# EAGLE design z-two (EAGLE 7.2.0)
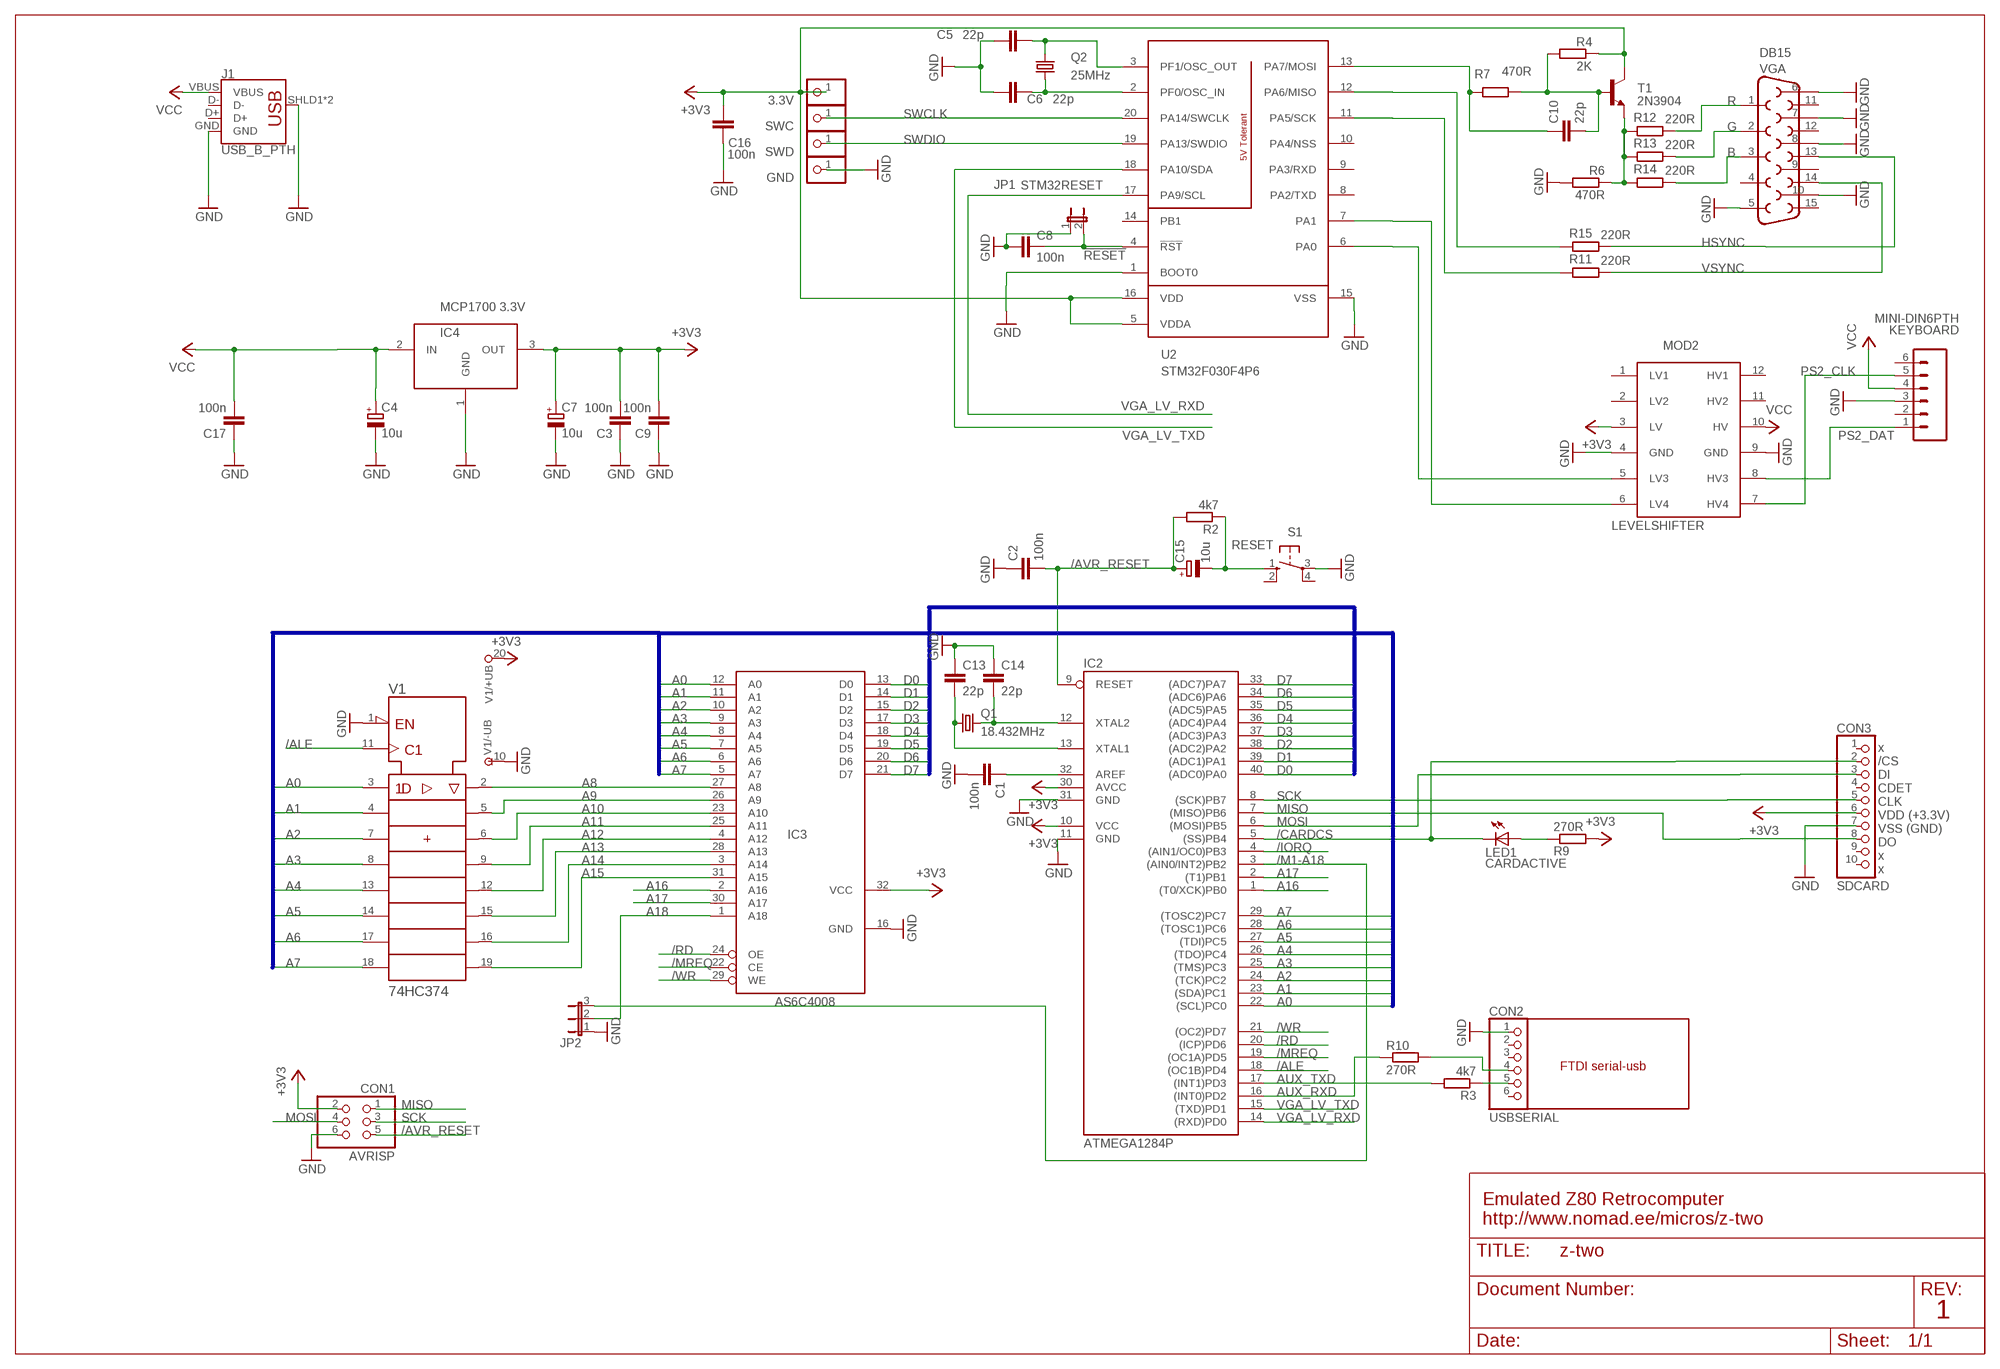
[diagram p0: schematic, sheet 1]

## Parts
3.3V  PINHD-1X1  [1X01]
C1  100n  C-EU025-025X050  [C025-025X050]
C2  100n  C-EU025-025X050  [C025-025X050]
C3  100n  C-EU025-025X050  [C025-025X050]
C4  10u  CPOL-EUE2.5-5  [E2,5-5]
C5  22p  C-EU025-025X050  [C025-025X050]
C6  22p  C-EU025-025X050  [C025-025X050]
C7  10u  CPOL-EUE2.5-5  [E2,5-5]
C8  100n  C-EU025-025X050  [C025-025X050]
C9  100n  C-EU025-025X050  [C025-025X050]
C10  22p  C-EU025-025X050  [C025-025X050]
C13  22p  C-EU025-025X050  [C025-025X050]
C14  22p  C-EU025-025X050  [C025-025X050]
C15  10u  CPOL-EUE2.5-5  [E2,5-5]
C16  100n  C-EU025-025X050  [C025-025X050]
C17  100n  C-EU025-025X050  [C025-025X050]
CON1  AVRISP  PINHD-2X3  [2X03]
CON2  USBSERIAL  PINHD-1X6  [1X06]
CON3  SDCARD  PINHD-1X10  [1X10]
GND  PINHD-1X1  [1X01]
IC2  ATMEGA1284P  MEGA32-P  [DIL40]
IC3  AS6C4008  AS6C4008DIP32  [DIP32]
IC4  MCP1700 3.3V  MCP1700TO92  [TO-92]
J1  USB_B_PTH  [USB-B-PTH]
JP1  STM32RESET  JUMPER-2PTH  [1X02]
JP2  JP2E  [JP2]
KEYBOARD  MINI-DIN6PTH  [MINI-DIN6]
LED1  CARDACTIVE  LED3MM  [LED3MM]
MOD2  LEVELSHIFTER  LEVELSHIFTERNARROW  [LAVELSHIFTER_N]
Q1  18.432MHz  CRYSTALHC49S  [HC49/S]
Q2  25MHz  CRYSTALHC49S  [HC49/S]
R2  4k7  R-EU_0204/7  [0204/7]
R3  4k7  R-EU_0204/7  [0204/7]
R4  2K  R-EU_0204/7  [0204/7]
R6  470R  R-EU_0204/7  [0204/7]
R7  470R  R-EU_0204/7  [0204/7]
R9  270R  R-EU_0204/7  [0204/7]
R10  270R  R-EU_0204/7  [0204/7]
R11  220R  R-EU_0204/7  [0204/7]
R12  220R  R-EU_0204/7  [0204/7]
R13  220R  R-EU_0204/7  [0204/7]
R14  220R  R-EU_0204/7  [0204/7]
R15  220R  R-EU_0204/7  [0204/7]
S1  RESET  10-XX  [B3F-10XX]
SWC  PINHD-1X1  [1X01]
SWD  PINHD-1X1  [1X01]
T1  2N3904  [TO92]
U2  STM32F030F4P6  MISC-PROCESSOR_STM32F030F4P6  [MISC-PROCESSOR_TSSOP20]
V1  74HC374  74374N  [DIL20]
VGA  DB15  [DB15]

## Nets
25MHZ: C5.2 Q2.2 U2.3(PF1/OSC_OUT)
!RESET: C8.1 JP1.2 U2.4(!RST)
+3V3: 3.3V.1 C3.2 C7.+ C9.2 C16.1 CON1.2 CON3.6 IC2.10(VCC) IC2.30(AVCC) IC3.32(VCC) IC4.3(OUT) MOD2.3(LV) R4.1 R9.2 T1.1(C) U2.5(VDDA) U2.16(VDD) V1.20(+UB)
/ALE: IC2.18((OC1B)PD4) V1.11(CLK)
/AVR_RESET: C2.2 C15.+ CON1.5 IC2.9(RESET) R2.2
/CARDCS: CON3.2 IC2.5((SS)PB4) LED1.K(C)
/IORQ: IC2.4((AIN1/OC0)PB3)
/M1-A18: IC2.3((AIN0/INT2)PB2) JP2.3
/MREQ: IC2.19((OC1A)PD5) IC3.22(CE)
/RD: IC2.20((ICP)PD6) IC3.24(OE)
/WR: IC2.21((OC2)PD7) IC3.29(WE)
A0: IC2.22((SCL)PC0) IC3.12(A0) V1.3(1D)
A1: IC2.23((SDA)PC1) IC3.11(A1) V1.4(2D)
A2: IC2.24((TCK)PC2) IC3.10(A2) V1.7(3D)
A3: IC2.25((TMS)PC3) IC3.9(A3) V1.8(4D)
A4: IC2.26((TDO)PC4) IC3.8(A4) V1.13(5D)
A5: IC2.27((TDI)PC5) IC3.7(A5) V1.14(6D)
A6: IC2.28((TOSC1)PC6) IC3.6(A6) V1.17(7D)
A7: IC2.29((TOSC2)PC7) IC3.5(A7) V1.18(8D)
A8: IC3.27(A8) V1.2(1Q)
A9: IC3.26(A9) V1.5(2Q)
A10: IC3.23(A10) V1.6(3Q)
A11: IC3.25(A11) V1.9(4Q)
A12: IC3.4(A12) V1.12(5Q)
A13: IC3.28(A13) V1.15(6Q)
A14: IC3.3(A14) V1.16(7Q)
A15: IC3.31(A15) V1.19(8Q)
A16: IC2.1((T0/XCK)PB0) IC3.2(A16)
A17: IC2.2((T1)PB1) IC3.30(A17)
A18: IC3.1(A18) JP2.2
AUX_RXD: IC2.16((INT0)PD2) R10.1
AUX_TXD: IC2.17((INT1)PD3) R3.2
B: R14.1 VGA.3
D0: IC2.40((ADC0)PA0) IC3.13(D0)
D1: IC2.39((ADC1)PA1) IC3.14(D1)
D2: IC2.38((ADC2)PA2) IC3.15(D2)
D3: IC2.37((ADC3)PA3) IC3.17(D3)
D4: IC2.36((ADC4)PA4) IC3.18(D4)
D5: IC2.35((ADC5)PA5) IC3.19(D5)
D6: IC2.34((ADC6)PA6) IC3.20(D6)
D7: IC2.33((ADC7)PA7) IC3.21(D7)
G: R13.1 VGA.2
GND: C1.2 C2.1 C3.1 C4.- C5.1 C6.1 C7.- C8.2 C9.1 C13.1 C14.1 C16.2 C17.1 CON1.6 CON2.1 CON3.7 GND.1 IC2.11(GND) IC2.31(GND) IC3.16(GND) IC4.1(GND) J1.GND J1.SHLD1(SHIELD) J1.SHLD2(SHIELD) JP1.1 JP2.1 KEYBOARD.3 MOD2.4(GND) MOD2.9(GND) R6.2 S1.3(P) U2.1(BOOT0) U2.15(VSS) V1.1(!OC) V1.10(-UB) VGA.5 VGA.6 VGA.7 VGA.8 VGA.10
HSYNC: R15.1 VGA.13
MISO: CON1.1 CON3.8 IC2.7((MISO)PB6)
MOSI: CON1.4 CON3.3 IC2.6((MOSI)PB5)
N$1: C6.2 Q2.1 U2.2(PF0/OSC_IN)
N$2: R15.2 U2.12(PA6/MISO)
N$4: R6.1 R12.2 R13.2 R14.2 T1.3(E)
N$5: C14.2 IC2.12(XTAL2) Q1.2
N$6: C1.1 IC2.32(AREF)
N$8: R11.2 U2.11(PA5/SCK)
N$9: MOD2.6(LV4) U2.7(PA1)
N$10: MOD2.5(LV3) U2.6(PA0)
N$11: C10.2 R4.2 R7.1 T1.2(B)
N$12: C10.1 R7.2 U2.13(PA7/MOSI)
N$15: CON2.5 R3.1
N$21: C13.2 IC2.13(XTAL1) Q1.1
N$104: CON2.4 R10.2
N$533: C15.- R2.1 S1.1(S)
N$693: LED1.A R9.1
PS2_CLK: KEYBOARD.5 MOD2.7(HV4)
PS2_DAT: KEYBOARD.1 MOD2.8(HV3)
R: R12.1 VGA.1
SCK: CON1.3 CON3.5 IC2.8((SCK)PB7)
SWCLK: SWC.1 U2.20(PA14/SWCLK)
SWDIO: SWD.1 U2.19(PA13/SWDIO)
VCC: C4.+ C17.2 IC4.2(IN) J1.VBUS KEYBOARD.4 MOD2.10(HV)
VGA_LV_RXD: IC2.14((RXD)PD0) U2.17(PA9/SCL)
VGA_LV_TXD: IC2.15((TXD)PD1) U2.18(PA10/SDA)
VSYNC: R11.1 VGA.14
Unconnected: CON2.2 CON2.3 CON2.6 CON3.1 CON3.4 CON3.9 CON3.10 J1.D+ J1.D- KEYBOARD.2 KEYBOARD.6 MOD2.1(LV1) MOD2.2(LV2) MOD2.11(HV2) MOD2.12(HV1) S1.2(S1) S1.4(P1) U2.8(PA2/TXD) U2.9(PA3/RXD) U2.10(PA4/NSS) U2.14(PB1) VGA.4 VGA.9 VGA.11 VGA.12 VGA.15

## Buses
A[0..15]
D[0..7]

## Notes on the sheet
- x
  /CS
  DI
  CDET
  CLK
  VDD (+3.3V)
  VSS (GND)
  DO
  x
  x
- FTDI serial-usb
- Emulated Z80 Retrocomputer
  http://www.nomad.ee/micros/z-two
- 1

## Library data of the parts
3.3V GND SWC SWD = pinhead:PINHD-1X1: PIN HEADER
C1-C3 C8 C9 C13 C14 C16 C17 = rcl:C-EU: CAPACITOR, European symbol; PARTNO: 0.1UF, 0603
C4 C7 C15 = rcl:CPOL-EU: POLARIZED CAPACITOR, European symbol
C5 C6 C10 = rcl:C-EU: CAPACITOR, European symbol; PARTNO: 22PF, 0603
CON1 = pinhead:PINHD-2X3: PIN HEADER
CON2 = pinhead:PINHD-1X6: PIN HEADER
CON3 = pinhead:PINHD-1X10: PIN HEADER
IC2 = atmel:MEGA32-P: MICROCONTROLLER 32 Kbytes FLASH 2 Kbytes SRAM 1 Kbytes EEPROM USART 8-channel 10 bit ADC Source: www.atmel.com .. doc2503.pdf; MPN: ATMEGA32-16PU; OC_FARNELL: 1661729; OC_NEWARK: 51P1794
IC3 = mast:AS6C4008
IC4 = mast:MCP1700
J1 = SparkFun-Connectors:USB_B: USB Type B Connector SparkFun Products: SparkFun Stepoko <https://www.sparkfun.com/products/13899> PTH; PROD_ID: CONN-08278; SF_ID: PRT-00139
JP1 = SparkFun-Retired:JUMPER-2: Jumper Basic 0.1" spaced jumper. Use with breakaway headers.
JP2 = jumper:JP2E: JUMPER
KEYBOARD = SparkFun-Retired:MINI-DIN6: Mini DIN 6 Connector SparkFun used to sell this connector and has used it on a couple designs, however the connector and the designs are now retired. Mini DIN 6 Connector [RETIRED] <https://www.sparkfun.com/products/retired/8509> SparkFun Key Counter - PS2 [RETIRED] <https://www.sparkfun.com/products/retired/8652> Commonly found on the back of a computer for PS2 keyboard and mice. Schematic and footprint are proven.
LED1 = led:LED: LED OSRAM: - CHIPLED LG R971, LG N971, LY N971, LG Q971, LY Q971, LO R971, LY R971 LH N974, LH R974 LS Q976, LO Q976, LY Q976 LO Q996 - Hyper CHIPLED LW Q18S LB Q993, LB Q99A, LB R99A - SideLED LS A670, LO A670, LY A670, LG A670, LP A670 LB A673, LV A673, LT A673, LW A673 LH A674 LY A675 LS A676, LA A676, LO A676, LY A676, LW A676 LS A679, LY A679, LG A679 - Hyper Micro SIDELED® LS Y876, LA Y876, LO Y876, LY Y876 LT Y87S - SmartLED LW L88C, LW L88S LB L89C, LB L89S, LG L890 LS L89K, LO L89K, LY L89K LS L896, LA L896, LO L896, LY L896 - TOPLED LS T670, LO T670, LY T670, LG T670, LP T670 LSG T670, LSP T670, LSY T670, LOP T670, LYG T670 LG T671, LOG T671, LSG T671 LB T673, LV T673, LT T673, LW T673 LH T674 LS T676, LA T676, LO T676, LY T676, LB T676, LH T676, LSB T676, LW T676 LB T67C, LV T67C, LT T67C, LS T67K, LO T67K, LY T67K, LW E67C LS E67B, LA E67B, LO E67B, LY E67B, LB E67C, LV E67C, LT E67C LW T67C LS T679, LY T679, LG T679 LS T770, LO T770, LY T770, LG T770, LP T770 LB T773, LV T773, LT T773, LW T773 LH T774 LS E675, LA E675, LY E675, LS T675 LS T776, LA T776, LO T776, LY T776, LB T776 LHGB T686 LT T68C, LB T68C - Hyper Mini TOPLED® LB M676 - Mini TOPLED Santana® LG M470 LS M47K, LO M47K, LY M47K Source: http://www.osram.convergy.de LUXEON: - LUMILED® LXK2-PW12-R00, LXK2-PW12-S00, LXK2-PW14-U00, LXK2-PW14-V00 LXK2-PM12-R00, LXK2-PM12-S00, LXK2-PM14-U00 LXK2-PE12-Q00, LXK2-PE12-R00, LXK2-PE12-S00, LXK2-PE14-T00, LXK2-PE14-U00 LXK2-PB12-K00, LXK2-PB12-L00, LXK2-PB12-M00, LXK2-PB14-N00, LXK2-PB14-P00, LXK2-PB14-Q00 LXK2-PR12-L00, LXK2-PR12-M00, LXK2-PR14-Q00, LXK2-PR14-R00 LXK2-PD12-Q00, LXK2-PD12-R00, LXK2-PD12-S00 LXK2-PH12-R00, LXK2-PH12-S00 LXK2-PL12-P00, LXK2-PL12-Q00, LXK2-PL12-R00 Source: www.luxeon.com KINGBRIGHT: KA-3528ASYC Source: www.kingbright.com
MOD2 = mast:LEVELSHIFTER
Q1 Q2 = crystal:CRYSTAL: CRYSTAL; OC_FARNELL: 1667008; OC_NEWARK: unknown
R2 R3 R10 = rcl:R-EU_: RESISTOR, European symbol
R4 = resistor:R-EU_: RESISTOR, European symbol; PARTNO: 2K, 0603
R6 R7 R9 = resistor:R-EU_: RESISTOR, European symbol; PARTNO: 475R, 0603
R11-R15 = resistor:R-EU_: RESISTOR, European symbol
S1 = switch-omron:10-XX: OMRON SWITCH; MPN: B3F-1000; OC_FARNELL: 176432; OC_NEWARK: 36M3542
T1 = transistor:2N3904: NPN TRANSISTOR
U2 = z80_tiny:MISC-PROCESSOR_STM32F030F4P6
V1 = 74ttl-din:74*374: Octal D type transparent LATCH, edge triggered
VGA = SparkFun-Retired:DB15: DB15 / VGA right angle through-hole female connector.

## Board
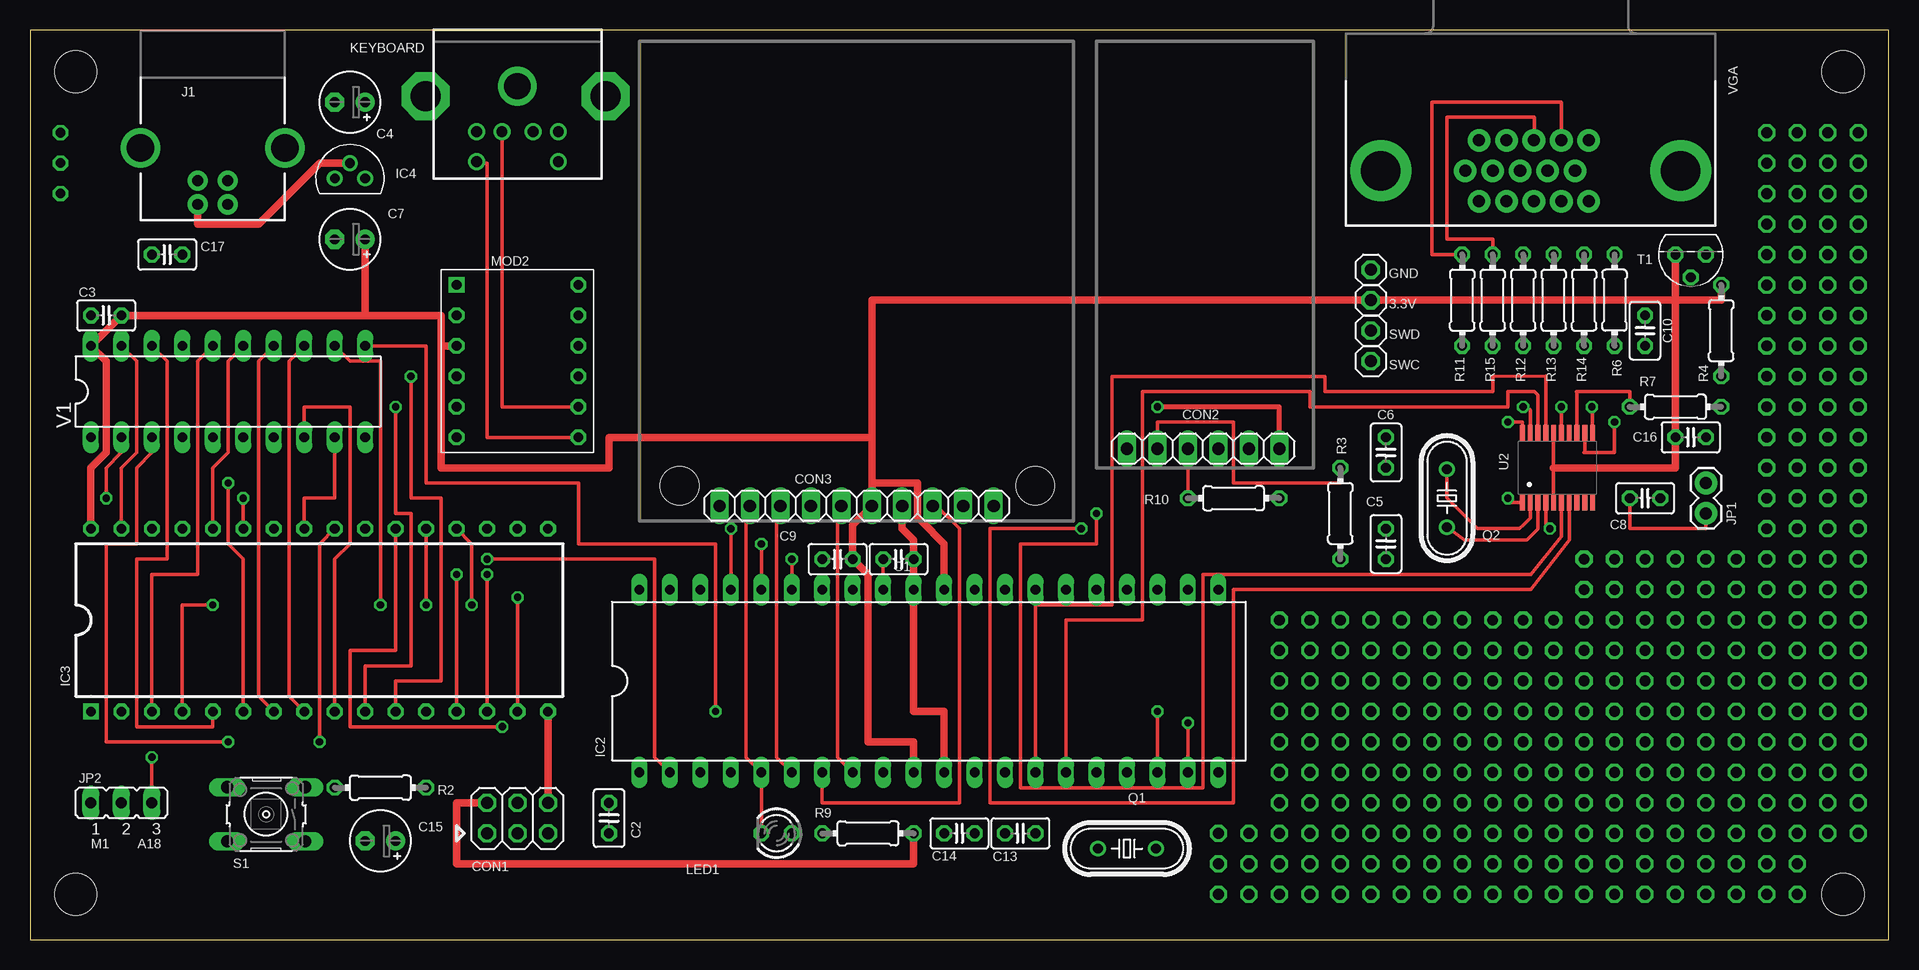
[diagram p1: board, top side]
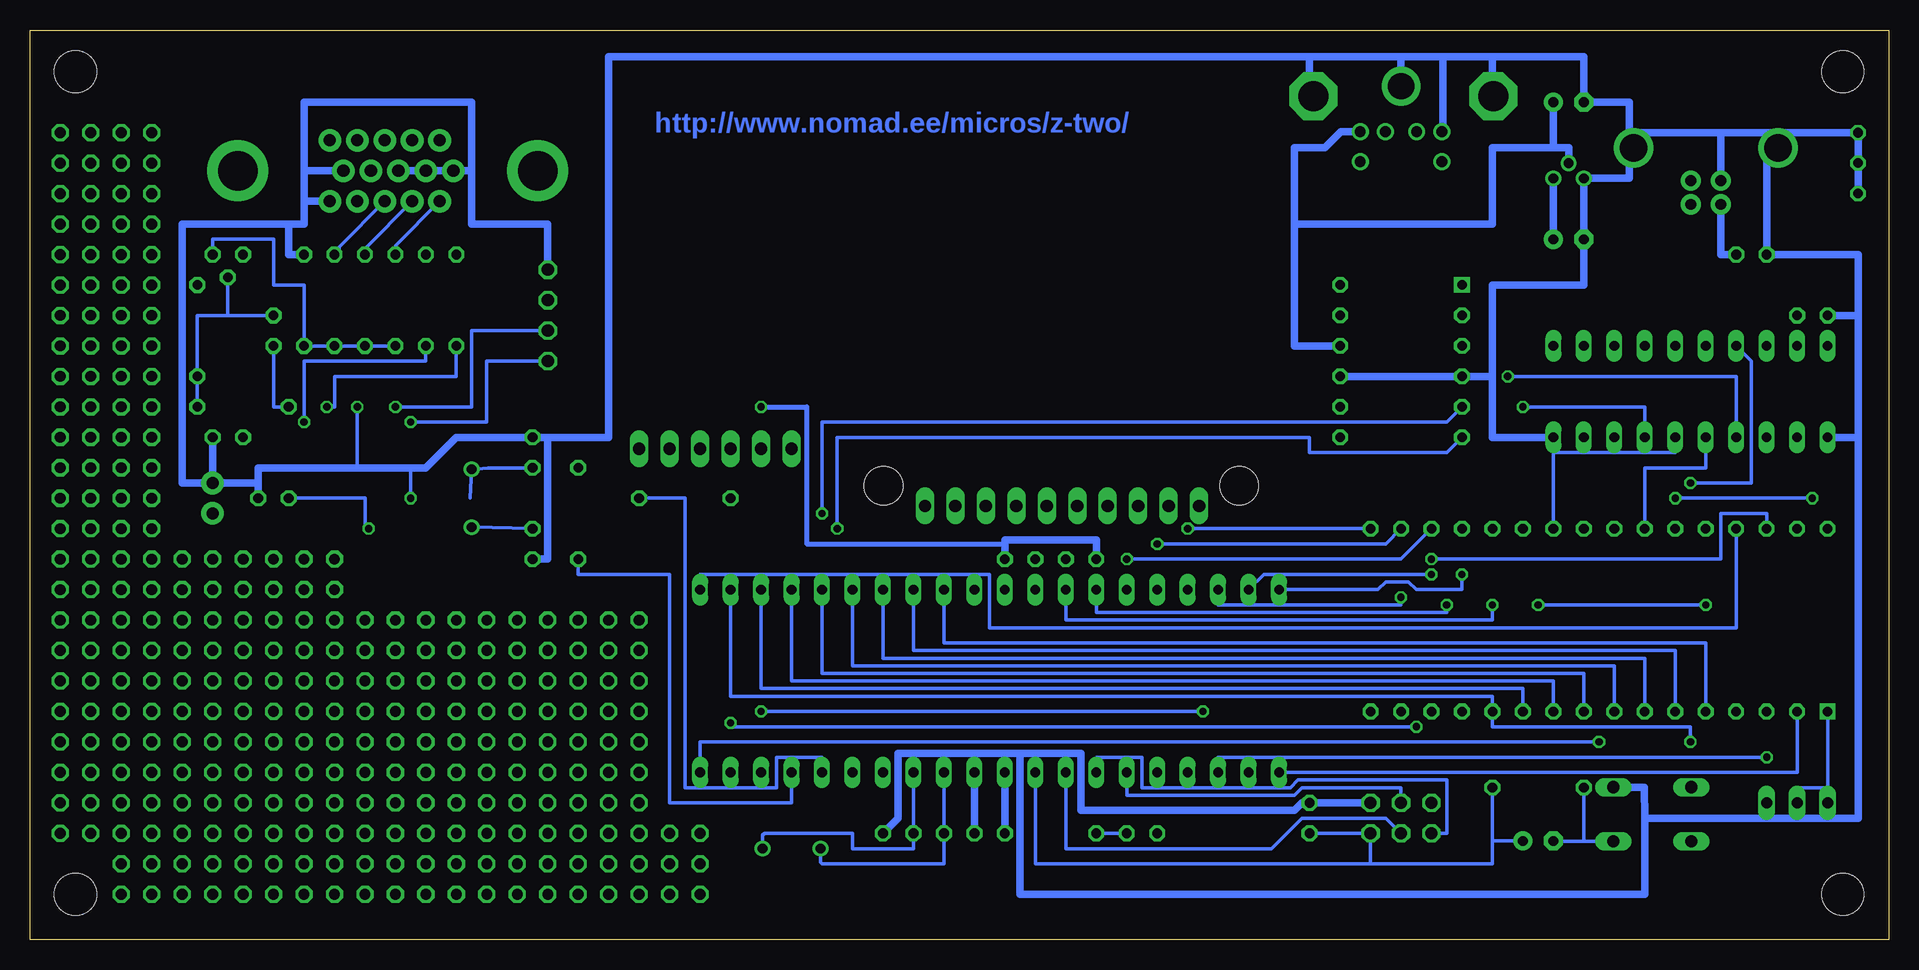
[diagram p2: board, bottom side, seen from below]

Size 154.92 x 75.87 mm. Coordinates in mm from the lower left corner, seen from the top.
Outline: 0,0 154.92,0 154.92,75.87 0,75.87 0,0
Copper layers (1*16): Top 0.035mm / dielectric 1.5mm / Bottom 0.035mm
Design rules "default *": minimum track width 10mil, minimum drill 0.3mm, track to track 10mil, track to pad 8mil, pad to pad 8mil, via to via 8mil, smd to smd 8mil, copper to edge 40mil, drill to drill 10mil, minimum pad ring 10mil, minimum via ring 8mil, stop-mask expansion 4mil, vias tented up to drill 0mil, thermal gap 10mil
Holes 3.5 mm at 3.81,72.39 3.81,3.81 151.13,3.81 151.13,72.39
Holes 3.2 mm at 83.78,37.87 54.14,37.87

### Footprints (pad centres in the part's own frame; a part is rotated, then mirrored left to right if it is on the bottom)
1X01 = drill 1.016 octagon: 1 0,0
C025-025X050 = drill 0.813 octagon: 1 -1.27,0; 2 1.27,0
E2,5-5 = drill 0.813 pad 1.6: + -1.27,0 | drill 0.813 pad 1.6 octagon: - 1.27,0
2X03 = drill 1.016 octagon: 1 -2.54,-1.27; 2 -2.54,1.27; 3 0,-1.27; 4 0,1.27; 5 2.54,-1.27; 6 2.54,1.27
1X06 = drill 1.016 long: 1 -6.35,0; 2 -3.81,0; 3 -1.27,0; 4 1.27,0; 5 3.81,0; 6 6.35,0
1X10 = drill 1.016 long: 1 -11.43,0; 2 -8.89,0; 3 -6.35,0; 4 -3.81,0; 5 -1.27,0; 6 1.27,0; 7 3.81,0; 8 6.35,0; 9 8.89,0; 10 11.43,0
DIL40 = drill 0.813 long: 1 -24.13,-7.62; 2 -21.59,-7.62; 3 -19.05,-7.62; 4 -16.51,-7.62; 5 -13.97,-7.62; 6 -11.43,-7.62; 7 -8.89,-7.62; 8 -6.35,-7.62; 9 -3.81,-7.62; 10 -1.27,-7.62; 11 1.27,-7.62; 12 3.81,-7.62; 13 6.35,-7.62; 14 8.89,-7.62; 15 11.43,-7.62; 16 13.97,-7.62; 17 16.51,-7.62; 18 19.05,-7.62; 19 21.59,-7.62; 20 24.13,-7.62; 21 24.13,7.62; 22 21.59,7.62; 23 19.05,7.62; 24 16.51,7.62; 25 13.97,7.62; 26 11.43,7.62; 27 8.89,7.62; 28 6.35,7.62; 29 3.81,7.62; 30 1.27,7.62; 31 -1.27,7.62; 32 -3.81,7.62; 33 -6.35,7.62; 34 -8.89,7.62; 35 -11.43,7.62; 36 -13.97,7.62; 37 -16.51,7.62; 38 -19.05,7.62; 39 -21.59,7.62; 40 -24.13,7.62
DIP32 = drill 0.8 square: 1 -7.62,19.05 | drill 0.8 octagon: 2 -7.62,16.51; 3 -7.62,13.97; 4 -7.62,11.43; 5 -7.62,8.89; 6 -7.62,6.35; 7 -7.62,3.81; 8 -7.62,1.27; 9 -7.62,-1.27; 10 -7.62,-3.81; 11 -7.62,-6.35; 12 -7.62,-8.89; 13 -7.62,-11.43; 14 -7.62,-13.97; 15 -7.62,-16.51; 16 -7.62,-19.05; 17 7.62,-19.05; 18 7.62,-16.51; 19 7.62,-13.97; 20 7.62,-11.43; 21 7.62,-8.89; 22 7.62,-6.35; 23 7.62,-3.81; 24 7.62,-1.27; 25 7.62,1.27; 26 7.62,3.81; 27 7.62,6.35; 28 7.62,8.89; 29 7.62,11.43; 30 7.62,13.97; 31 7.62,16.51; 32 7.62,19.05
TO-92 = drill 0.8: 1 0,1.27; 2 1.27,0; 3 0,-1.27
USB-B-PTH = drill 0.914 pad 1.676: D+ 4,1.25; D- 5.981,1.25; GND 4,-1.25; VBUS 5.981,-1.25 | drill 2.286: SHLD1 1.282,-6.02; SHLD2 1.282,6.02
1X02 = drill 1.016 pad 1.88: 1 0,0; 2 2.54,0
JP2 = drill 0.914 long: 1 -2.54,0; 2 0,0; 3 2.54,0
MINI-DIN6 = drill 0.9: 1 -1.3,-8.5; 2 1.3,-8.5; 3 -3.4,-8.5; 4 3.4,-8.5; 5 -3.4,-11; 6 3.4,-11 | drill 2.2: P$1 0,-4.7
LED3MM = drill 0.813 octagon: A -1.27,0; K 1.27,0
LAVELSHIFTER_N = drill 0.8 square: 1 -6.35,-5.08 | drill 0.8 octagon: 2 -3.81,-5.08; 3 -1.27,-5.08; 4 1.27,-5.08; 5 3.81,-5.08; 6 6.35,-5.08; 7 6.35,5.08; 8 3.81,5.08; 9 1.27,5.08; 10 -1.27,5.08; 11 -3.81,5.08; 12 -6.35,5.08
HC49/S = drill 0.813: 1 -2.413,0; 2 2.413,0
0204/7 = drill 0.813 octagon: 1 -3.81,0; 2 3.81,0
B3F-10XX = drill 1.016 long: 1 -3.251,2.261; 2 3.251,2.261; 3 -3.251,-2.261; 4 3.251,-2.261
TO92 = drill 0.813 octagon: 1 1.27,0; 2 0,1.905; 3 -1.27,0
MISC-PROCESSOR_TSSOP20 = smd 0.4 x 1.35: 1 -2.925,-2.875; 2 -2.275,-2.875; 3 -1.625,-2.875; 4 -0.975,-2.875; 5 -0.325,-2.875; 6 0.325,-2.875; 7 0.975,-2.875; 8 1.625,-2.875; 9 2.275,-2.875; 10 2.925,-2.875; 11 2.925,2.875; 12 2.275,2.875; 13 1.625,2.875; 14 0.975,2.875; 15 0.325,2.875; 16 -0.325,2.875; 17 -0.975,2.875; 18 -1.625,2.875; 19 -2.275,2.875; 20 -2.925,2.875
DIL20 = drill 0.813 long: 1 -11.43,-3.81; 2 -8.89,-3.81; 3 -6.35,-3.81; 4 -3.81,-3.81; 5 -1.27,-3.81; 6 1.27,-3.81; 7 3.81,-3.81; 8 6.35,-3.81; 9 8.89,-3.81; 10 11.43,-3.81; 11 11.43,3.81; 12 8.89,3.81; 13 6.35,3.81; 14 3.81,3.81; 15 1.27,3.81; 16 -1.27,3.81; 17 -3.81,3.81; 18 -6.35,3.81; 19 -8.89,3.81; 20 -11.43,3.81
DB15 = drill 1.016 pad 1.88: 1 -4.32,-7.62; 2 -2.03,-7.62; 3 0.26,-7.62; 4 2.55,-7.62; 5 4.84,-7.62; 6 -5.46,-5.08; 7 -3.17,-5.08; 8 -0.88,-5.08; 9 1.41,-5.08; 10 3.7,-5.08; 11 -4.32,-2.54; 12 -2.03,-2.54; 13 0.26,-2.54; 14 2.55,-2.54; 15 4.84,-2.54 | drill 3.302 pad 5.08: G1 -12.5,-5.08; G2 12.5,-5.08

### Placement (x,y rotation side)
3.3V  111.76,53.34 0 top
C1  72.39,31.75 0 top
C2  48.26,10.16 270 top
C3  6.35,52.07 0 top
C4  26.67,69.85 180 top
C5  113.03,33.02 90 top
C6  113.03,40.64 270 top
C7  26.67,58.42 180 top
C8  134.62,36.83 0 top
C9  67.31,31.75 0 top
C10  134.62,50.8 90 top
C13  82.55,8.89 180 top
C14  77.47,8.89 0 top
C15  29.21,8.25 180 top
C16  138.43,41.91 0 top
C17  11.43,57.15 0 top
CON1  40.64,10.16 0 top
CON2  97.79,40.96 180 top
CON3  68.9,36.2 0 top
GND  111.76,55.88 0 top
IC2  74.93,21.59 0 top
IC3  24.13,26.67 90 top
IC4  26.67,63.5 90 top
J1  15.24,67.31 270 top
JP1  139.7,38.1 270 top
JP2  7.62,11.43 0 top
KEYBOARD  40.64,75.88 0 top
LED1  62.23,8.89 180 top
MOD2  40.64,48.26 270 top
Q1  91.44,7.62 180 top
Q2  118.11,36.83 270 top
R2  29.21,12.7 0 top
R3  109.22,35.56 270 top
R4  140.97,50.8 270 top
R6  132.08,53.34 90 top
R7  137.16,44.45 180 top
R9  69.85,8.89 0 top
R10  100.33,36.83 180 top
R11  119.38,53.34 270 top
R12  124.46,53.34 270 top
R13  127,53.34 270 top
R14  129.54,53.34 270 top
R15  121.92,53.34 270 top
S1  19.68,10.48 180 top
SWC  111.76,48.26 0 top
SWD  111.76,50.8 0 top
T1  138.43,57.15 180 top
U2  127.32,39.37 0 top
V1  16.51,45.72 0 top
VGA  125.09,69.22 0 top

### Tracks (layer width: path | path; a pad name or v marks a point on that pad's centre or on a via)
25MHZ
  Top 0.305: U2.3 125.69,34.25 124.78,33.34 123.51,33.34 119.57,33.34 Q2.2
  Bottom 0.305: Q2.2 C5.2
!RESET  (via drill 0.6 pad 0.61)
  Top 0.305: 133.35,34.29 139.7,34.29 | 139.7,34.29 JP1.2 | 133.35,34.29 139.7,34.29 | 133.35,34.29 C8.1 | U2.4 126.34,34.63 v126.68,34.29
  Bottom 0.305: C8.1 127,36.83 127,34.29 v126.68,34.29
+3V3
  Top 0.305: 74.3,34.92 73.98,35.24 | 70.17,38.1 CON3.6 | U2.5 126.99,39.37 U2.16 | 137.16,49.53 137.16,53.34
  Top 0.61: IC3.32 5.08,39.37 6.35,40.64 6.35,48.26 V1.20 C3.2 27.94,52.07 | 27.94,52.07 C7.+ | IC2.10 73.66,16.51 71.12,16.51 69.85,16.51 69.85,27.94 69.85,30.48 C9.2 68.58,34.61 CON3.6 70.17,40.64 70.17,41.91 | IC2.30 76.2,33.02 74.3,34.92 | 73.98,35.24 73.98,38.1 70.17,38.1 | 27.94,52.07 34.29,52.07 34.29,49.53 | 34.29,49.53 34.29,39.37 48.26,39.37 48.26,41.91 70.17,41.91 | MOD2.3 34.29,49.53 | CON1.2 35.56,11.43 35.56,6.35 73.66,6.35 R9.2 | 137.16,53.34 3.3V.1 70.17,53.34 70.17,41.91 | 137.16,53.34 137.16,49.53 137.16,44.45 | 137.16,53.34 T1.1 | 137.16,44.45 C16.1 137.16,44.45 | 137.16,44.45 137.16,39.37 127,39.37 | 127,39.37 126.99,39.37 127,39.37 | R4.1 140.97,53.34 137.16,53.34
  Bottom 0.61: R9.2 IC2.10 | IC4.3 C7.+
/ALE  (via drill 0.6 pad 0.61)
  Top 0.305: V1.11 33.02,49.53 33.02,38.1 35.56,38.1 45.72,38.1 45.72,36.83 45.72,33.02 57.15,33.02 v57.15,19.05 | v93.98,19.05 IC2.18
  Bottom 0.305: v57.15,19.05 v93.98,19.05
/AVR_RESET
  Bottom 0.305: C15.+ 33.02,8.25 | 33.02,8.25 R2.2 | CON1.5 43.18,6.35 | 43.18,6.35 33.02,6.35 33.02,8.25 | CON1.5 43.18,6.35 | 43.18,6.35 71.12,6.35 IC2.9 | C2.2 CON1.5
/CARDCS
  Top 0.305: LED1.K IC2.5 59.69,15.24 59.69,35.88 CON3.2
/M1-A18  (via drill 0.6 pad 0.61)
  Top 0.305: JP2.3 v10.16,15.24
  Bottom 0.305: IC2.3 55.88,15.24 v10.16,15.24
/MREQ  (via drill 0.6 pad 0.41)
  Top 0.305: IC3.22 30.48,24.13 26.67,24.13 26.67,17.78 v39.37,17.78 | IC2.19 v96.52,18.1
  Bottom 0.305: v39.37,17.78 96.52,17.78 96.84,18.1 v96.52,18.1
/RD  (via drill 0.6 pad 0.41)
  Top 0.305: IC3.24 24.13,33.02 24.13,17.78 v24.13,16.51
  Bottom 0.305: v24.13,16.51 45.72,16.51 46.04,16.51 86.04,16.51 99.06,16.51 IC2.20
/WR
  Bottom 0.305: IC3.29 12.7,26.04 74.93,26.04 74.93,30.48 99.06,30.48 IC2.21
A0  (via drill 0.6 pad 0.41)
  Top 0.305: V1.3 10.16,40.64 8.89,39.37 8.89,33.02 7.62,33.02 6.35,33.02 6.35,16.51 v16.51,16.51
  Bottom 0.305: IC2.22 96.52,21.59 96.52,20.32 33.02,20.32 IC3.12 33.02,17.78 31.75,17.78 16.51,17.78 v16.51,16.51
A1  (via drill 0.6 pad 0.41)
  Top 0.305: v31.75,46.99 31.75,36.83 34.29,36.83 34.29,22.86 34.29,21.59 30.48,21.59 IC3.11
  Bottom 0.305: IC2.23 93.98,21.59 93.98,20.96 30.48,20.96 IC3.11 | V1.4 12.7,46.99 v31.75,46.99
A2  (via drill 0.6 pad 0.41)
  Top 0.305: v30.48,44.45 30.48,35.56 31.75,35.56 31.75,22.86 27.94,22.86 IC3.10
  Bottom 0.305: IC2.24 91.44,21.59 27.94,21.59 IC3.10 | V1.7 20.32,44.45 v30.48,44.45
A3
  Top 0.305: IC3.9 25.4,31.75 26.67,33.02 26.67,36.83 26.67,39.37 26.67,44.45 22.86,44.45 V1.8
  Bottom 0.305: IC2.25 88.9,22.54 88.9,22.22 75.88,22.22 58.42,22.22 25.4,22.22 IC3.9
A4
  Top 0.305: V1.13 21.59,48.26 21.59,20.32 IC3.8
  Bottom 0.305: IC2.26 86.36,22.86 76.2,22.86 58.42,22.86 22.86,22.86 IC3.8
A5
  Top 0.305: V1.14 19.05,48.26 19.05,21.59 19.05,20.32 IC3.7
  Bottom 0.305: IC2.27 83.82,23.5 76.2,23.5 58.42,23.5 20.32,23.5 IC3.7
A6  (via drill 0.6 pad 0.41)
  Top 0.305: IC3.6 17.78,31.75 16.51,33.02 v16.51,38.1
  Bottom 0.305: IC2.28 81.28,24.13 76.2,24.13 58.42,24.13 17.78,24.13 IC3.6 | v16.51,38.1 11.43,38.1 11.43,48.26 V1.17
A7
  Top 0.305: IC3.5 15.24,17.78 8.89,17.78 8.89,31.75 11.43,31.75 11.43,48.26 V1.18
  Bottom 0.305: IC2.29 78.74,24.77 76.2,24.77 58.42,24.77 15.24,24.77 IC3.5
A8  (via drill 0.6 pad 0.41)
  Top 0.305: V1.2 7.62,40.64 6.35,39.37 v6.35,36.83 | v17.78,36.83 IC3.27
  Bottom 0.305: v6.35,36.83 v17.78,36.83
A9
  Bottom 0.305: IC3.26 20.32,39.37 15.24,39.37 V1.5
A10
  Bottom 0.305: IC3.23 27.94,40.64 17.78,40.64 V1.6
A11
  Top 0.305: IC3.25 22.86,36.83 25.4,36.83 V1.9
A12  (via drill 0.6 pad 0.41)
  Top 0.305: V1.12 26.67,48.26 29.21,48.26 v29.21,27.94 | v15.24,27.94 12.7,27.94 IC3.4
  Bottom 0.305: v29.21,27.94 v15.24,27.94
A13
  Top 0.305: IC3.28 15.24,39.37 16.51,40.64 16.51,48.26 V1.15
A14
  Top 0.305: IC3.3 10.16,30.48 13.97,30.48 13.97,48.26 V1.16
A15
  Top 0.305: V1.19 8.89,48.26 8.89,40.64 7.62,39.37 IC3.31
A16
  Bottom 0.305: IC3.2 7.62,15.24 7.62,13.97 16.51,13.97 17.78,13.97 41.91,13.97 IC2.1
A17  (via drill 0.6 pad 0.41)
  Top 0.305: IC2.2 52.07,15.24 52.07,31.75 45.72,31.75 39.37,31.75 v38.1,31.75
  Bottom 0.305: v38.1,31.75 13.97,31.75 13.97,35.56 10.16,35.56 IC3.30
A18
  Bottom 0.305: JP2.2 7.62,12.7 5.08,12.7 IC3.1
AUX_RXD
  Bottom 0.305: R10.1 100.33,36.83 100.33,12.7 92.71,12.7 92.71,15.24 88.9,15.24 IC2.16
AUX_TXD
  Bottom 0.305: R3.2 109.22,30.48 101.6,30.48 101.6,22.86 101.6,11.43 91.44,11.43 IC2.17
B
  Bottom 0.305: R14.1 129.16,57.53 129.16,57.79 VGA.3
D0  (via drill 0.6 pad 0.41)
  Top 0.305: IC3.13 v35.56,30.48
  Bottom 0.305: v35.56,30.48 35.56,29.21 39.37,29.21 40.01,29.85 41.91,29.85 42.55,29.21 IC2.40
D1  (via drill 0.6 pad 0.41)
  Top 0.305: IC3.14 v38.1,30.48
  Bottom 0.305: v38.1,30.48 52.07,30.48 IC2.39
D2  (via drill 0.6 pad 0.41)
  Top 0.305: IC3.15 v40.64,28.57
  Bottom 0.305: v40.64,28.57 40.64,27.94 55.88,27.94 IC2.38
D3  (via drill 0.6 pad 0.41)
  Top 0.305: IC2.37 v58.42,34.29
  Bottom 0.305: v58.42,34.29 IC3.17
D4  (via drill 0.6 pad 0.41)
  Top 0.305: IC2.36 v60.96,33.02
  Bottom 0.305: v60.96,33.02 41.91,33.02 IC3.18
D5  (via drill 0.6 pad 0.41)
  Top 0.305: IC2.35 v63.5,31.75
  Bottom 0.305: v63.5,31.75 40.64,31.75 IC3.19
D6  (via drill 0.6 pad 0.41)
  Top 0.305: v36.83,27.94 36.83,33.02 IC3.20
  Bottom 0.305: IC2.34 66.04,27.94 66.04,27.31 36.83,27.31 v36.83,27.94
D7  (via drill 0.6 pad 0.41)
  Top 0.305: v33.02,27.94 IC3.21
  Bottom 0.305: IC2.33 68.58,27.94 68.58,26.67 33.02,26.67 v33.02,27.94
G
  Bottom 0.305: R13.1 127,57.66 VGA.2
GND  (via drill 0.6 pad 0.61, 0.8 pad 1.27)
  Top 0.305: U2.15 v127.64,44.44 v127.64,44.45 | U2.1 123.53,36.5 v123.19,36.83
  Top 0.406: CON2.1 104.14,44.45 v93.98,44.45
  Top 0.61: IC2.11 76.2,19.05 73.66,19.05 IC2.31 C1.2 73.66,33.34 72.71,34.29 CON3.7 | IC3.16 CON1.6
  Bottom 0.305: VGA.10 132.08,64.14 | 124.46,39.37 127.64,39.37 | 127.64,39.37 129.54,39.37 135.89,39.37 | 76.2,15.56 76.2,15.24 IC2.11 | 2.54,41.91 V1.1 | 2.54,52.07 C3.1 | 33.02,46.99 MOD2.4 | v127.64,44.45 127.64,39.37 | v123.19,36.83 123.19,39.37
  Bottom 0.406: v93.98,44.45 90.17,44.45 90.17,33.02 73.66,33.02
  Bottom 0.61: 13.99,67.29 J1.GND 13.99,67.29 | 13.99,67.29 13.97,67.31 | 13.97,67.31 8.89,67.31 | 8.89,67.31 8.89,66.36 J1.SHLD1 10.16,65.09 10.16,64.77 C17.1 2.54,57.15 2.54,52.07 | 13.99,67.29 13.97,67.31 | 13.97,67.31 21.59,67.31 | 21.59,67.31 21.59,66.36 J1.SHLD2 21.59,65.7 21.59,63.5 IC4.1 C7.- 25.4,54.61 33.02,54.61 33.02,49.53 33.02,48.26 33.02,46.99 | 21.59,67.31 21.59,69.85 C4.- 25.4,73.66 33.02,73.66 | 36.83,73.66 37.15,73.66 37.15,67.48 KEYBOARD.3 | 36.83,73.66 33.02,73.66 | R6.2 133.35,57.15 133.35,59.69 | 135.89,38.1 135.89,39.37 129.54,39.37 127.64,39.37 124.46,39.37 123.19,39.37 121.92,39.37 119.38,41.91 115.57,41.91 106.68,41.91 | 135.89,38.1 JP1.1 | VGA.8 VGA.7 VGA.6 118.11,64.14 | GND.1 111.76,59.69 113.03,59.69 118.11,59.69 118.11,62.23 118.11,64.14 | JP1.1 142.24,38.1 142.24,59.69 133.35,59.69 | 132.08,64.14 132.08,63.11 132.08,61.59 | C8.2 135.89,38.1 | 135.89,38.1 JP1.1 | VGA.10 132.08,64.14 | 132.08,64.14 132.08,69.85 118.11,69.85 118.11,64.14 | 33.02,73.66 33.02,72.39 | 36.83,73.66 40.64,73.66 | 40.64,73.66 40.64,72.39 | 40.64,73.66 48.26,73.66 | 48.26,73.66 48.26,71.76 | C5.1 111.76,31.75 111.76,41.91 C6.1 106.68,41.91 | C16.2 JP1.1 | 8.89,67.31 v2.54,67.31 v2.54,64.77 v2.54,62.23 | 2.54,52.07 C3.1 | C14.1 IC2.11 76.2,15.24 76.2,15.56 | C13.1 82.55,10.16 82.55,15.56 76.2,15.56 | 2.54,41.91 2.54,19.05 2.54,10.16 5.08,10.16 | V1.1 2.54,41.91 | 2.54,41.91 2.54,52.07 | CON1.6 C2.1 48.9,11.43 49.53,10.79 67.31,10.79 67.31,11.43 67.31,15.56 | 76.2,15.56 67.31,15.56 | 67.31,15.56 72.39,15.56 72.39,3.81 30.48,3.81 20.4,3.81 20.32,3.81 | V1.10 30.48,41.91 33.02,41.91 33.02,46.99 | MOD2.9 MOD2.4 33.02,46.99
  Bottom 0.61: 106.68,41.91 106.68,73.66 48.26,73.66 | 73.66,33.34 72.71,33.34 | 72.71,33.34 66.04,33.34 66.04,33.02 C9.1 | 72.71,33.34 73.34,33.34 73.66,33.34 | 73.66,33.34 73.66,33.02 C1.2 | 20.32,3.81 20.32,10.16 | 20.32,10.16 5.08,10.16 | S1.3 20.36,12.74 20.32,10.16 | 20.32,10.16 20.32,3.81 | JP2.1 5.08,10.16 | 132.08,61.59 VGA.5 | 133.35,59.69 132.08,59.69 132.08,61.59
HSYNC
  Top 0.305: R15.1 121.92,58.42 118.11,58.42 118.11,68.58 125.41,68.58 125.41,67.69 VGA.13
MISO
  Top 0.305: CON3.8 75.56,36.2 77.47,34.29 77.47,11.43 66.04,11.43 IC2.7
  Bottom 0.305: IC2.7 66.04,15.24 62.23,15.24 62.23,12.7 49.85,12.7 49.21,13.34 36.83,13.34 36.83,8.89 CON1.1
MOSI
  Top 0.305: IC2.6 62.23,15.24 62.23,35.88 CON3.3
  Bottom 0.305: CON1.4 40.64,12.7 46.99,12.7 48.26,12.7 48.9,12.7 49.53,12.07 63.5,12.07 63.5,12.38 IC2.6
N$1
  Top 0.305: U2.2 125.04,35.19 124.46,34.61 124.14,34.29 121.92,34.29 120.65,34.29 118.11,36.83 Q2.1
  Bottom 0.305: C6.2 116.71,39.37 Q2.1 118.24,36.83
N$2  (via drill 0.6 pad 0.61)
  Top 0.305: U2.12 129.59,40.69 129.54,40.64 132.08,40.64 v132.08,43.18
  Bottom 0.305: 132.08,44.45 v132.08,43.18 132.08,44.45 | 132.08,44.45 132.08,48.26 121.92,48.26 R15.2
N$4
  Bottom 0.305: R12.2 R13.2 R14.2 R6.1 132.08,50.8 132.08,54.61 134.62,54.61 134.62,58.42 139.7,58.42 T1.3
N$5
  Bottom 0.305: Q1.2 89.03,6.48 88.9,6.35 78.74,6.35 C14.2 IC2.12
N$6
  Top 0.305: C1.1 IC2.32
N$7  (via drill 0.9 pad 1.42)
  other vias: 106.68,24.13
N$8  (via drill 0.6 pad 0.61)
  Top 0.305: U2.11 130.24,44.38 v130.18,44.45
  Bottom 0.305: 129.54,44.45 v130.18,44.45 129.54,44.45 | 129.54,44.45 129.54,46.99 119.38,46.99 R11.2
N$9  (via drill 0.6 pad 0.41)
  Top 0.305: v87.63,34.29 80.01,34.29 80.01,27.94 80.01,11.43 100.33,11.43 100.33,26.67 100.33,29.21 111.12,29.21 125.09,29.21 128.29,33.36 U2.7
  Bottom 0.305: MOD2.6 36.83,40.64 48.26,40.64 48.26,41.91 87.63,41.91 v87.63,34.29
N$10  (via drill 0.6 pad 0.41)
  Top 0.305: U2.6 127.64,33.65 125.1,30.49 111.12,30.48 97.79,30.48 97.79,27.94 97.79,12.7 82.55,12.7 82.55,26.67 82.55,33.02 88.9,33.02 v88.9,35.56
  Bottom 0.305: MOD2.5 36.83,43.18 86.36,43.18 87.63,43.18 88.9,43.18 v88.9,35.56
N$11
  Bottom 0.305: R7.1 R4.2 140.97,52.07 138.43,52.07 | 138.43,52.07 T1.2 138.43,52.07 | 138.43,52.07 C10.2
N$12
  Top 0.305: R7.2 133.35,45.72 128.91,45.72 128.94,45.68 U2.13
  Bottom 0.305: C10.1 134.62,44.45 R7.2
N$13  (via drill 0.9 pad 1.42)
  other vias: 109.22,24.13
N$14  (via drill 0.9 pad 1.42)
  other vias: 104.14,24.13
N$15
  Top 0.305: R3.1 109.22,38.1 100.33,38.1 100.33,43.18 93.98,43.18 CON2.5
N$16  (via drill 0.9 pad 1.42)
  other vias: 111.76,24.13
N$17  (via drill 0.9 pad 1.42)
  other vias: 114.3,24.13
N$18  (via drill 0.9 pad 1.42)
  other vias: 116.84,24.13
N$19  (via drill 0.9 pad 1.42)
  other vias: 119.38,24.13
N$20  (via drill 0.9 pad 1.42)
  other vias: 121.92,24.13
N$21
  Bottom 0.305: Q1.1 93.85,8.76 93.66,8.89 91.44,8.89 86.36,8.89 86.36,7.62 81.28,7.62 81.28,10.16 | 81.28,10.16 C13.2 | IC2.13 81.28,10.16
N$22  (via drill 0.9 pad 1.42)
  other vias: 106.68,26.67
N$23  (via drill 0.9 pad 1.42)
  other vias: 124.46,24.13
N$24  (via drill 0.9 pad 1.42)
  other vias: 127,24.13
N$25  (via drill 0.9 pad 1.42)
  other vias: 129.54,24.13
N$26  (via drill 0.9 pad 1.42)
  other vias: 132.08,24.13
N$27  (via drill 0.9 pad 1.42)
  other vias: 134.62,24.13
N$28  (via drill 0.9 pad 1.42)
  other vias: 137.16,24.13
N$29  (via drill 0.9 pad 1.42)
  other vias: 139.7,24.13
N$30  (via drill 0.9 pad 1.42)
  other vias: 142.24,24.13
N$31  (via drill 0.9 pad 1.42)
  other vias: 144.78,24.13
N$32  (via drill 0.9 pad 1.42)
  other vias: 147.32,24.13
N$33  (via drill 0.9 pad 1.42)
  other vias: 149.86,24.13
N$34  (via drill 0.9 pad 1.42)
  other vias: 104.14,21.59
N$35  (via drill 0.9 pad 1.42)
  other vias: 106.68,21.59
N$36  (via drill 0.9 pad 1.42)
  other vias: 109.22,21.59
N$37  (via drill 0.9 pad 1.42)
  other vias: 111.76,21.59
N$38  (via drill 0.9 pad 1.42)
  other vias: 114.3,21.59
N$39  (via drill 0.9 pad 1.42)
  other vias: 116.84,21.59
N$40  (via drill 0.9 pad 1.42)
  other vias: 119.38,21.59
N$41  (via drill 0.9 pad 1.42)
  other vias: 121.92,21.59
N$42  (via drill 0.9 pad 1.42)
  other vias: 124.46,21.59
N$43  (via drill 0.9 pad 1.42)
  other vias: 127,21.59
N$44  (via drill 0.9 pad 1.42)
  other vias: 129.54,21.59
N$45  (via drill 0.9 pad 1.42)
  other vias: 132.08,21.59
N$46  (via drill 0.9 pad 1.42)
  other vias: 134.62,21.59
N$47  (via drill 0.9 pad 1.42)
  other vias: 137.16,21.59
N$48  (via drill 0.9 pad 1.42)
  other vias: 139.7,21.59
N$49  (via drill 0.9 pad 1.42)
  other vias: 142.24,21.59
N$50  (via drill 0.9 pad 1.42)
  other vias: 144.78,21.59
N$51  (via drill 0.9 pad 1.42)
  other vias: 147.32,21.59
N$52  (via drill 0.9 pad 1.42)
  other vias: 149.86,21.59
N$53  (via drill 0.9 pad 1.42)
  other vias: 104.14,19.05
N$54  (via drill 0.9 pad 1.42)
  other vias: 106.68,19.05
N$55  (via drill 0.9 pad 1.42)
  other vias: 147.32,26.67
N$56  (via drill 0.9 pad 1.42)
  other vias: 149.86,26.67
N$57  (via drill 0.9 pad 1.42)
  other vias: 147.32,29.21
N$58  (via drill 0.9 pad 1.42)
  other vias: 149.86,29.21
N$59  (via drill 0.9 pad 1.42)
  other vias: 147.32,31.75
N$60  (via drill 0.9 pad 1.42)
  other vias: 149.86,31.75
N$62  (via drill 0.9 pad 1.42)
  other vias: 149.86,34.29
N$64  (via drill 0.9 pad 1.42)
  other vias: 149.86,36.83
N$65  (via drill 0.9 pad 1.42)
  other vias: 147.32,39.37
N$66  (via drill 0.9 pad 1.42)
  other vias: 149.86,39.37
N$67  (via drill 0.9 pad 1.42)
  other vias: 147.32,41.91
N$68  (via drill 0.9 pad 1.42)
  other vias: 149.86,41.91
N$69  (via drill 0.9 pad 1.42)
  other vias: 147.32,44.45
N$70  (via drill 0.9 pad 1.42)
  other vias: 149.86,44.45
N$71  (via drill 0.9 pad 1.42)
  other vias: 147.32,46.99
N$72  (via drill 0.9 pad 1.42)
  other vias: 149.86,46.99
N$73  (via drill 0.9 pad 1.42)
  other vias: 147.32,49.53
N$74  (via drill 0.9 pad 1.42)
  other vias: 149.86,49.53
N$75  (via drill 0.9 pad 1.42)
  other vias: 147.32,52.07
N$76  (via drill 0.9 pad 1.42)
  other vias: 149.86,52.07
N$77  (via drill 0.9 pad 1.42)
  other vias: 147.32,54.61
N$78  (via drill 0.9 pad 1.42)
  other vias: 149.86,54.61
N$79  (via drill 0.9 pad 1.42)
  other vias: 147.32,57.15
N$80  (via drill 0.9 pad 1.42)
  other vias: 149.86,57.15
N$81  (via drill 0.9 pad 1.42)
  other vias: 147.32,59.69
N$82  (via drill 0.9 pad 1.42)
  other vias: 149.86,59.69
N$83  (via drill 0.9 pad 1.42)
  other vias: 147.32,62.23
N$84  (via drill 0.9 pad 1.42)
  other vias: 149.86,62.23
N$85  (via drill 0.9 pad 1.42)
  other vias: 147.32,64.77
N$86  (via drill 0.9 pad 1.42)
  other vias: 149.86,64.77
N$87  (via drill 0.9 pad 1.42)
  other vias: 147.32,67.31
N$88  (via drill 0.9 pad 1.42)
  other vias: 149.86,67.31
N$89  (via drill 0.9 pad 1.42)
  other vias: 104.14,16.51
N$90  (via drill 0.9 pad 1.42)
  other vias: 104.14,13.97
N$91  (via drill 0.9 pad 1.42)
  other vias: 104.14,11.43
N$92  (via drill 0.9 pad 1.42)
  other vias: 104.14,8.89
N$93  (via drill 0.9 pad 1.42)
  other vias: 104.14,6.35
N$94  (via drill 0.9 pad 1.42)
  other vias: 106.68,6.35
N$95  (via drill 0.9 pad 1.42)
  other vias: 106.68,8.89
N$96  (via drill 0.9 pad 1.42)
  other vias: 106.68,11.43
N$97  (via drill 0.9 pad 1.42)
  other vias: 106.68,13.97
N$98  (via drill 0.9 pad 1.42)
  other vias: 106.68,16.51
N$99  (via drill 0.9 pad 1.42)
  other vias: 109.22,19.05
N$100  (via drill 0.9 pad 1.42)
  other vias: 109.22,16.51
N$101  (via drill 0.9 pad 1.42)
  other vias: 109.22,13.97
N$102  (via drill 0.9 pad 1.42)
  other vias: 109.22,11.43
N$103  (via drill 0.9 pad 1.42)
  other vias: 104.14,26.67
N$104
  Top 0.305: R10.2 96.52,38.1 96.52,39.69 CON2.4
N$105  (via drill 0.9 pad 1.42)
  other vias: 109.22,8.89
N$106  (via drill 0.9 pad 1.42)
  other vias: 109.22,6.35
N$107  (via drill 0.9 pad 1.42)
  other vias: 111.76,6.35
N$108  (via drill 0.9 pad 1.42)
  other vias: 111.76,8.89
N$109  (via drill 0.9 pad 1.42)
  other vias: 111.76,11.43
N$110  (via drill 0.9 pad 1.42)
  other vias: 111.76,13.97
N$111  (via drill 0.9 pad 1.42)
  other vias: 111.76,16.51
N$112  (via drill 0.9 pad 1.42)
  other vias: 111.76,19.05
N$113  (via drill 0.9 pad 1.42)
  other vias: 114.3,19.05
N$114  (via drill 0.9 pad 1.42)
  other vias: 114.3,16.51
N$115  (via drill 0.9 pad 1.42)
  other vias: 114.3,13.97
N$116  (via drill 0.9 pad 1.42)
  other vias: 114.3,11.43
N$117  (via drill 0.9 pad 1.42)
  other vias: 114.3,8.89
N$118  (via drill 0.9 pad 1.42)
  other vias: 114.3,6.35
N$119  (via drill 0.9 pad 1.42)
  other vias: 116.84,6.35
N$120  (via drill 0.9 pad 1.42)
  other vias: 119.38,6.35
N$121  (via drill 0.9 pad 1.42)
  other vias: 121.92,6.35
N$122  (via drill 0.9 pad 1.42)
  other vias: 124.46,6.35
N$123  (via drill 0.9 pad 1.42)
  other vias: 127,6.35
N$124  (via drill 0.9 pad 1.42)
  other vias: 129.54,6.35
N$125  (via drill 0.9 pad 1.42)
  other vias: 132.08,6.35
N$126  (via drill 0.9 pad 1.42)
  other vias: 134.62,6.35
N$127  (via drill 0.9 pad 1.42)
  other vias: 137.16,6.35
N$128  (via drill 0.9 pad 1.42)
  other vias: 139.7,6.35
N$129  (via drill 0.9 pad 1.42)
  other vias: 116.84,8.89
N$130  (via drill 0.9 pad 1.42)
  other vias: 116.84,11.43
N$131  (via drill 0.9 pad 1.42)
  other vias: 116.84,13.97
N$132  (via drill 0.9 pad 1.42)
  other vias: 116.84,16.51
N$133  (via drill 0.9 pad 1.42)
  other vias: 116.84,19.05
N$134  (via drill 0.9 pad 1.42)
  other vias: 119.38,19.05
N$135  (via drill 0.9 pad 1.42)
  other vias: 119.38,16.51
N$136  (via drill 0.9 pad 1.42)
  other vias: 119.38,13.97
N$137  (via drill 0.9 pad 1.42)
  other vias: 119.38,11.43
N$138  (via drill 0.9 pad 1.42)
  other vias: 119.38,8.89
N$139  (via drill 0.9 pad 1.42)
  other vias: 121.92,8.89
N$140  (via drill 0.9 pad 1.42)
  other vias: 121.92,11.43
N$141  (via drill 0.9 pad 1.42)
  other vias: 121.92,13.97
N$142  (via drill 0.9 pad 1.42)
  other vias: 121.92,16.51
N$143  (via drill 0.9 pad 1.42)
  other vias: 121.92,19.05
N$144  (via drill 0.9 pad 1.42)
  other vias: 124.46,19.05
N$145  (via drill 0.9 pad 1.42)
  other vias: 124.46,16.51
N$146  (via drill 0.9 pad 1.42)
  other vias: 124.46,13.97
N$147  (via drill 0.9 pad 1.42)
  other vias: 124.46,11.43
N$148  (via drill 0.9 pad 1.42)
  other vias: 124.46,8.89
N$149  (via drill 0.9 pad 1.42)
  other vias: 127,8.89
N$150  (via drill 0.9 pad 1.42)
  other vias: 127,11.43
N$151  (via drill 0.9 pad 1.42)
  other vias: 127,13.97
N$152  (via drill 0.9 pad 1.42)
  other vias: 127,16.51
N$153  (via drill 0.9 pad 1.42)
  other vias: 127,19.05
N$154  (via drill 0.9 pad 1.42)
  other vias: 129.54,19.05
N$155  (via drill 0.9 pad 1.42)
  other vias: 129.54,16.51
N$156  (via drill 0.9 pad 1.42)
  other vias: 129.54,13.97
N$157  (via drill 0.9 pad 1.42)
  other vias: 129.54,11.43
N$158  (via drill 0.9 pad 1.42)
  other vias: 129.54,8.89
N$159  (via drill 0.9 pad 1.42)
  other vias: 132.08,8.89
N$160  (via drill 0.9 pad 1.42)
  other vias: 132.08,11.43
N$161  (via drill 0.9 pad 1.42)
  other vias: 132.08,13.97
N$162  (via drill 0.9 pad 1.42)
  other vias: 132.08,16.51
N$163  (via drill 0.9 pad 1.42)
  other vias: 132.08,19.05
N$164  (via drill 0.9 pad 1.42)
  other vias: 134.62,19.05
N$165  (via drill 0.9 pad 1.42)
  other vias: 134.62,16.51
N$166  (via drill 0.9 pad 1.42)
  other vias: 134.62,13.97
N$167  (via drill 0.9 pad 1.42)
  other vias: 134.62,11.43
N$168  (via drill 0.9 pad 1.42)
  other vias: 134.62,8.89
N$169  (via drill 0.9 pad 1.42)
  other vias: 137.16,8.89
N$170  (via drill 0.9 pad 1.42)
  other vias: 139.7,8.89
N$171  (via drill 0.9 pad 1.42)
  other vias: 142.24,8.89
N$172  (via drill 0.9 pad 1.42)
  other vias: 142.24,6.35
N$173  (via drill 0.9 pad 1.42)
  other vias: 144.78,6.35
N$174  (via drill 0.9 pad 1.42)
  other vias: 144.78,8.89
N$175  (via drill 0.9 pad 1.42)
  other vias: 149.86,11.43
N$176  (via drill 0.9 pad 1.42)
  other vias: 147.32,11.43
N$177  (via drill 0.9 pad 1.42)
  other vias: 144.78,11.43
N$178  (via drill 0.9 pad 1.42)
  other vias: 142.24,11.43
N$179  (via drill 0.9 pad 1.42)
  other vias: 139.7,11.43
N$180  (via drill 0.9 pad 1.42)
  other vias: 137.16,11.43
N$181  (via drill 0.9 pad 1.42)
  other vias: 137.16,13.97
N$182  (via drill 0.9 pad 1.42)
  other vias: 139.7,13.97
N$183  (via drill 0.9 pad 1.42)
  other vias: 142.24,13.97
N$184  (via drill 0.9 pad 1.42)
  other vias: 144.78,13.97
N$185  (via drill 0.9 pad 1.42)
  other vias: 147.32,13.97
N$186  (via drill 0.9 pad 1.42)
  other vias: 149.86,13.97
N$187  (via drill 0.9 pad 1.42)
  other vias: 149.86,16.51
N$188  (via drill 0.9 pad 1.42)
  other vias: 147.32,16.51
N$189  (via drill 0.9 pad 1.42)
  other vias: 144.78,16.51
N$190  (via drill 0.9 pad 1.42)
  other vias: 142.24,16.51
N$191  (via drill 0.9 pad 1.42)
  other vias: 139.7,16.51
N$192  (via drill 0.9 pad 1.42)
  other vias: 137.16,16.51
N$193  (via drill 0.9 pad 1.42)
  other vias: 137.16,19.05
N$194  (via drill 0.9 pad 1.42)
  other vias: 139.7,19.05
N$195  (via drill 0.9 pad 1.42)
  other vias: 142.24,19.05
N$196  (via drill 0.9 pad 1.42)
  other vias: 144.78,19.05
N$197  (via drill 0.9 pad 1.42)
  other vias: 147.32,19.05
N$198  (via drill 0.9 pad 1.42)
  other vias: 149.86,19.05
N$199  (via drill 0.9 pad 1.42)
  other vias: 152.4,67.31
N$200  (via drill 0.9 pad 1.42)
  other vias: 152.4,64.77
N$201  (via drill 0.9 pad 1.42)
  other vias: 152.4,62.23
N$202  (via drill 0.9 pad 1.42)
  other vias: 152.4,59.69
N$203  (via drill 0.9 pad 1.42)
  other vias: 152.4,57.15
N$204  (via drill 0.9 pad 1.42)
  other vias: 152.4,54.61
N$205  (via drill 0.9 pad 1.42)
  other vias: 152.4,52.07
N$206  (via drill 0.9 pad 1.42)
  other vias: 152.4,49.53
N$207  (via drill 0.9 pad 1.42)
  other vias: 152.4,46.99
N$208  (via drill 0.9 pad 1.42)
  other vias: 152.4,44.45
N$209  (via drill 0.9 pad 1.42)
  other vias: 152.4,41.91
N$210  (via drill 0.9 pad 1.42)
  other vias: 152.4,39.37
N$211  (via drill 0.9 pad 1.42)
  other vias: 152.4,36.83
N$212  (via drill 0.9 pad 1.42)
  other vias: 152.4,34.29
N$213  (via drill 0.9 pad 1.42)
  other vias: 152.4,31.75
N$214  (via drill 0.9 pad 1.42)
  other vias: 152.4,29.21
N$215  (via drill 0.9 pad 1.42)
  other vias: 152.4,26.67
N$216  (via drill 0.9 pad 1.42)
  other vias: 152.4,24.13
N$217  (via drill 0.9 pad 1.42)
  other vias: 152.4,21.59
N$218  (via drill 0.9 pad 1.42)
  other vias: 152.4,19.05
N$219  (via drill 0.9 pad 1.42)
  other vias: 152.4,16.51
N$220  (via drill 0.9 pad 1.42)
  other vias: 152.4,13.97
N$221  (via drill 0.9 pad 1.42)
  other vias: 152.4,11.43
N$222  (via drill 0.9 pad 1.42)
  other vias: 147.32,8.89
N$223  (via drill 0.9 pad 1.42)
  other vias: 149.86,8.89
N$224  (via drill 0.9 pad 1.42)
  other vias: 152.4,8.89
N$225  (via drill 0.9 pad 1.42)
  other vias: 144.78,3.81
N$226  (via drill 0.9 pad 1.42)
  other vias: 142.24,3.81
N$227  (via drill 0.9 pad 1.42)
  other vias: 139.7,3.81
N$228  (via drill 0.9 pad 1.42)
  other vias: 137.16,3.81
N$229  (via drill 0.9 pad 1.42)
  other vias: 134.62,3.81
N$230  (via drill 0.9 pad 1.42)
  other vias: 132.08,3.81
N$231  (via drill 0.9 pad 1.42)
  other vias: 129.54,3.81
N$232  (via drill 0.9 pad 1.42)
  other vias: 127,3.81
N$233  (via drill 0.9 pad 1.42)
  other vias: 124.46,3.81
N$234  (via drill 0.9 pad 1.42)
  other vias: 121.92,3.81
N$235  (via drill 0.9 pad 1.42)
  other vias: 119.38,3.81
N$236  (via drill 0.9 pad 1.42)
  other vias: 116.84,3.81
N$237  (via drill 0.9 pad 1.42)
  other vias: 114.3,3.81
N$238  (via drill 0.9 pad 1.42)
  other vias: 111.76,3.81
N$239  (via drill 0.9 pad 1.42)
  other vias: 109.22,3.81
N$240  (via drill 0.9 pad 1.42)
  other vias: 106.68,3.81
N$241  (via drill 0.9 pad 1.42)
  other vias: 104.14,3.81
N$242  (via drill 0.9 pad 1.42)
  other vias: 101.6,8.89
N$243  (via drill 0.9 pad 1.42)
  other vias: 101.6,6.35
N$244  (via drill 0.9 pad 1.42)
  other vias: 101.6,3.81
N$245  (via drill 0.9 pad 1.42)
  other vias: 99.06,3.81
N$246  (via drill 0.9 pad 1.42)
  other vias: 99.06,6.35
N$247  (via drill 0.9 pad 1.42)
  other vias: 99.06,8.89
N$248  (via drill 0.9 pad 1.42)
  other vias: 109.22,26.67
N$249  (via drill 0.9 pad 1.42)
  other vias: 111.76,26.67
N$250  (via drill 0.9 pad 1.42)
  other vias: 114.3,26.67
N$251  (via drill 0.9 pad 1.42)
  other vias: 116.84,26.67
N$252  (via drill 0.9 pad 1.42)
  other vias: 119.38,26.67
N$253  (via drill 0.9 pad 1.42)
  other vias: 121.92,26.67
N$254  (via drill 0.9 pad 1.42)
  other vias: 124.46,26.67
N$255  (via drill 0.9 pad 1.42)
  other vias: 127,26.67
N$256  (via drill 0.9 pad 1.42)
  other vias: 129.54,26.67
N$257  (via drill 0.9 pad 1.42)
  other vias: 132.08,26.67
N$258  (via drill 0.9 pad 1.42)
  other vias: 134.62,26.67
N$259  (via drill 0.9 pad 1.42)
  other vias: 137.16,26.67
N$260  (via drill 0.9 pad 1.42)
  other vias: 139.7,26.67
N$261  (via drill 0.9 pad 1.42)
  other vias: 142.24,26.67
N$262  (via drill 0.9 pad 1.42)
  other vias: 144.78,26.67
N$263  (via drill 0.9 pad 1.42)
  other vias: 144.78,29.21
N$264  (via drill 0.9 pad 1.42)
  other vias: 144.78,31.75
N$265  (via drill 0.9 pad 1.42)
  other vias: 144.78,34.29
N$266  (via drill 0.9 pad 1.42)
  other vias: 144.78,36.83
N$267  (via drill 0.9 pad 1.42)
  other vias: 144.78,39.37
N$268  (via drill 0.9 pad 1.42)
  other vias: 144.78,41.91
N$269  (via drill 0.9 pad 1.42)
  other vias: 144.78,44.45
N$270  (via drill 0.9 pad 1.42)
  other vias: 144.78,46.99
N$271  (via drill 0.9 pad 1.42)
  other vias: 144.78,49.53
N$272  (via drill 0.9 pad 1.42)
  other vias: 144.78,52.07
N$273  (via drill 0.9 pad 1.42)
  other vias: 144.78,54.61
N$274  (via drill 0.9 pad 1.42)
  other vias: 144.78,57.15
N$275  (via drill 0.9 pad 1.42)
  other vias: 144.78,59.69
N$276  (via drill 0.9 pad 1.42)
  other vias: 144.78,62.23
N$277  (via drill 0.9 pad 1.42)
  other vias: 144.78,64.77
N$278  (via drill 0.9 pad 1.42)
  other vias: 144.78,67.31
N$279  (via drill 0.9 pad 1.42)
  other vias: 132.08,31.75
N$280  (via drill 0.9 pad 1.42)
  other vias: 132.08,29.21
N$281  (via drill 0.9 pad 1.42)
  other vias: 129.54,29.21
N$282  (via drill 0.9 pad 1.42)
  other vias: 129.54,31.75
N$283  (via drill 0.9 pad 1.42)
  other vias: 134.62,31.75
N$284  (via drill 0.9 pad 1.42)
  other vias: 134.62,29.21
N$285  (via drill 0.9 pad 1.42)
  other vias: 137.16,29.21
N$286  (via drill 0.9 pad 1.42)
  other vias: 137.16,31.75
N$287  (via drill 0.9 pad 1.42)
  other vias: 139.7,31.75
N$288  (via drill 0.9 pad 1.42)
  other vias: 139.7,29.21
N$289  (via drill 0.9 pad 1.42)
  other vias: 142.24,29.21
N$290  (via drill 0.9 pad 1.42)
  other vias: 142.24,31.75
N$291  (via drill 0.9 pad 1.42)
  other vias: 147.32,34.29
N$292  (via drill 0.9 pad 1.42)
  other vias: 147.32,36.83
N$293  (via drill 0.9 pad 1.42)
  other vias: 147.32,6.35
N$294  (via drill 0.9 pad 1.42)
  other vias: 147.32,3.81
N$533
  Bottom 0.305: S1.1 25.4,8.22 | 25.4,8.22 27.34,8.22 C15.- | R2.1 25.4,8.22
N$684  (via drill 2.5 pad 4)
  other vias: 47.96,70.37
N$685  (via drill 2.5 pad 4)
  other vias: 32.96,70.37
N$693
  Bottom 0.305: R9.1 LED1.A
PS2_CLK
  Top 0.305: MOD2.7 38.1,41.91 38.1,59.69 38.1,64.77 37.35,64.77 KEYBOARD.5
PS2_DAT
  Top 0.305: MOD2.8 39.37,44.45 39.37,60.96 39.37,66.04 39.37,67.35 KEYBOARD.1
R
  Bottom 0.305: R12.1 124.46,57.91 VGA.1
SCK
  Top 0.305: IC2.8 67.31,15.24 67.31,35.88 CON3.5
  Bottom 0.305: CON1.3 41.91,10.16 48.9,10.16 50.16,8.89 51.44,7.62 68.58,7.62 68.58,10.16 IC2.8
SWCLK  (via drill 0.6 pad 0.61)
  Top 0.305: v123.19,43.18 124.38,43.18 U2.20
  Bottom 0.305: SWC.1 116.84,48.26 116.84,43.18 v123.19,43.18
SWDIO  (via drill 0.6 pad 0.61)
  Top 0.305: U2.19 125.04,43.55 125.04,44.19 124.78,44.45 124.14,44.45 v124.46,44.45
  Bottom 0.305: SWD.1 118.11,50.8 118.11,49.53 118.11,44.45 v124.46,44.45
VCC
  Top 0.61: IC4.2 24.13,64.77 19.05,59.69 13.99,59.69 J1.VBUS
  Bottom 0.305: 13.97,57.15 13.99,57.15
  Bottom 0.61: C4.+ 27.94,66.04 | 27.94,66.04 26.67,66.04 | 26.67,66.04 IC4.2 | 27.94,66.04 33.02,66.04 33.02,59.69 49.53,59.69 | 27.94,66.04 26.67,66.04 | C17.2 13.97,57.15 | 13.99,57.15 J1.VBUS | MOD2.10 49.53,49.53 49.53,59.69 | KEYBOARD.4 45.65,67.38 46.99,66.04 49.53,66.04 49.53,59.69
VGA_LV_RXD
  Top 0.305: U2.17 126.34,47.01 121.92,46.99 121.92,45.72 107.95,45.72 107.95,46.99 93.98,46.99 90.17,46.99 90.17,27.94 83.82,27.94 IC2.14
VGA_LV_TXD
  Top 0.305: IC2.15 86.36,26.67 92.71,26.67 92.71,45.72 93.98,45.72 106.68,45.72 106.68,44.45 123.19,44.45 123.19,45.72 125.41,45.72 125.69,45.44 U2.18
VSYNC
  Top 0.305: R11.1 116.84,57.15 116.84,69.85 127.64,69.85 127.64,67.94 VGA.14

### Text on the board
Bottom: http://www.nomad.ee/micros/z-two/
tPlace: M1 A18
tNames: IC4
tValues: MCP1700